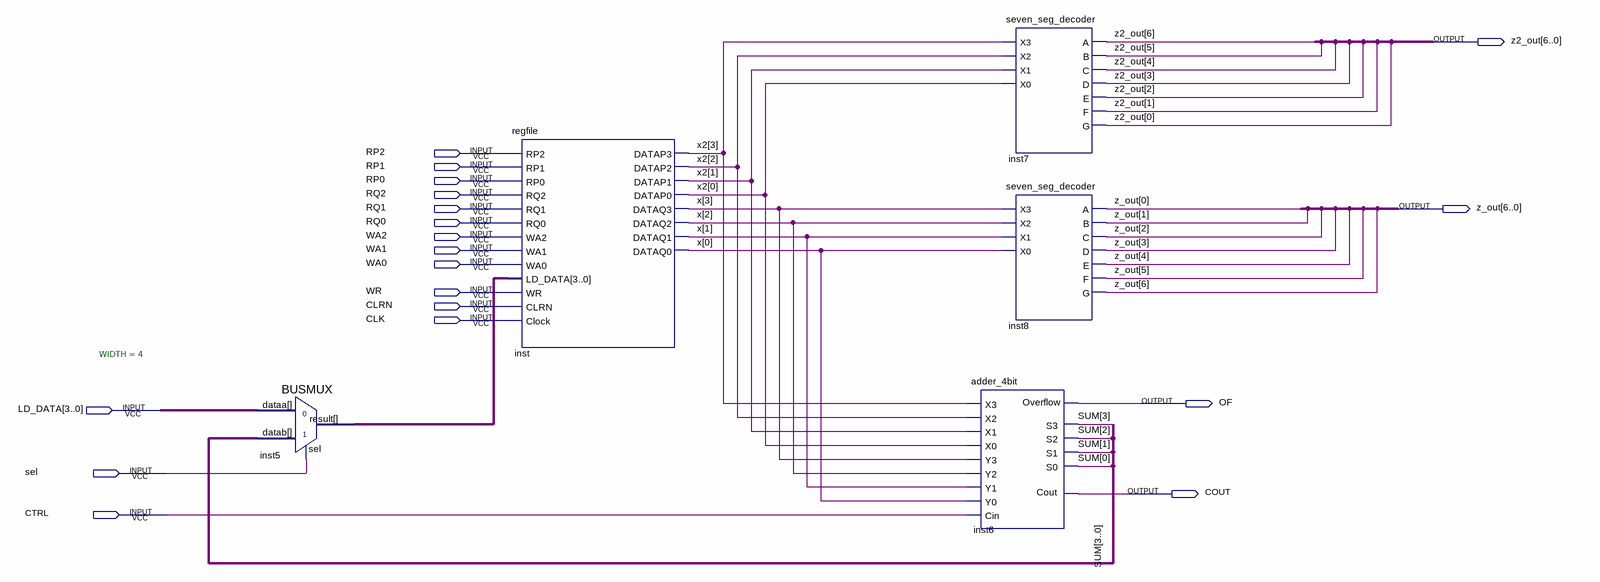
[diagram p0: schematic sheet]
// Quartus schematic step3.bdf as structural Verilog: 5 symbols, 19 pins
module step3 (
  input  RP2,
  input  RP1,
  input  RP0,
  input  RQ2,
  input  RQ1,
  input  RQ0,
  input  WA2,
  input  WA1,
  input  WA0,
  input  WR,
  input  CLRN,
  input  CLK,
  input  [3:0] LD_DATA,
  input  sel,
  input  CTRL,
  output [6:0] z2_out,
  output [6:0] z_out,
  output OF,
  output COUT
);

  wire [3:0] inst5_result, SUM, x, x2;

  BUSMUX #(.WIDTH(4)) inst5 (.datab(SUM), .sel(sel), .dataa(LD_DATA), .result(inst5_result));
  regfile inst (
    .RP2(RP2), .RP1(RP1), .RP0(RP0), .RQ2(RQ2), .RQ1(RQ1), .RQ0(RQ0), .WA2(WA2), .WA1(WA1), .WA0(WA0),
    .LD_DATA(inst5_result), .WR(WR), .CLRN(CLRN), .Clock(CLK), .DATAP3(x2[3]), .DATAP2(x2[2]),
    .DATAP1(x2[1]), .DATAP0(x2[0]), .DATAQ3(x[3]), .DATAQ2(x[2]), .DATAQ1(x[1]), .DATAQ0(x[0]));
  adder_4bit inst6 (
    .X3(x2[3]), .Y3(x[3]), .X2(x2[2]), .Y2(x[2]), .X1(x2[1]), .Y1(x[1]), .X0(x2[0]), .Y0(x[0]), .Cin(CTRL),
    .S3(SUM[3]), .S2(SUM[2]), .S1(SUM[1]), .S0(SUM[0]), .Overflow(OF), .Cout(COUT));
  seven_seg_decoder inst7 (
    .X3(x2[3]), .X2(x2[2]), .X1(x2[1]), .X0(x2[0]), .A(z2_out[6]), .B(z2_out[5]), .C(z2_out[4]),
    .D(z2_out[3]), .E(z2_out[2]), .F(z2_out[1]), .G(z2_out[0]));
  seven_seg_decoder inst8 (
    .X3(x[3]), .X2(x[2]), .X1(x[1]), .X0(x[0]), .A(z_out[0]), .B(z_out[1]), .C(z_out[2]), .D(z_out[3]),
    .E(z_out[4]), .F(z_out[5]), .G(z_out[6]));
endmodule
